# EAGLE design IC382_safety (EAGLE 7.5.0)
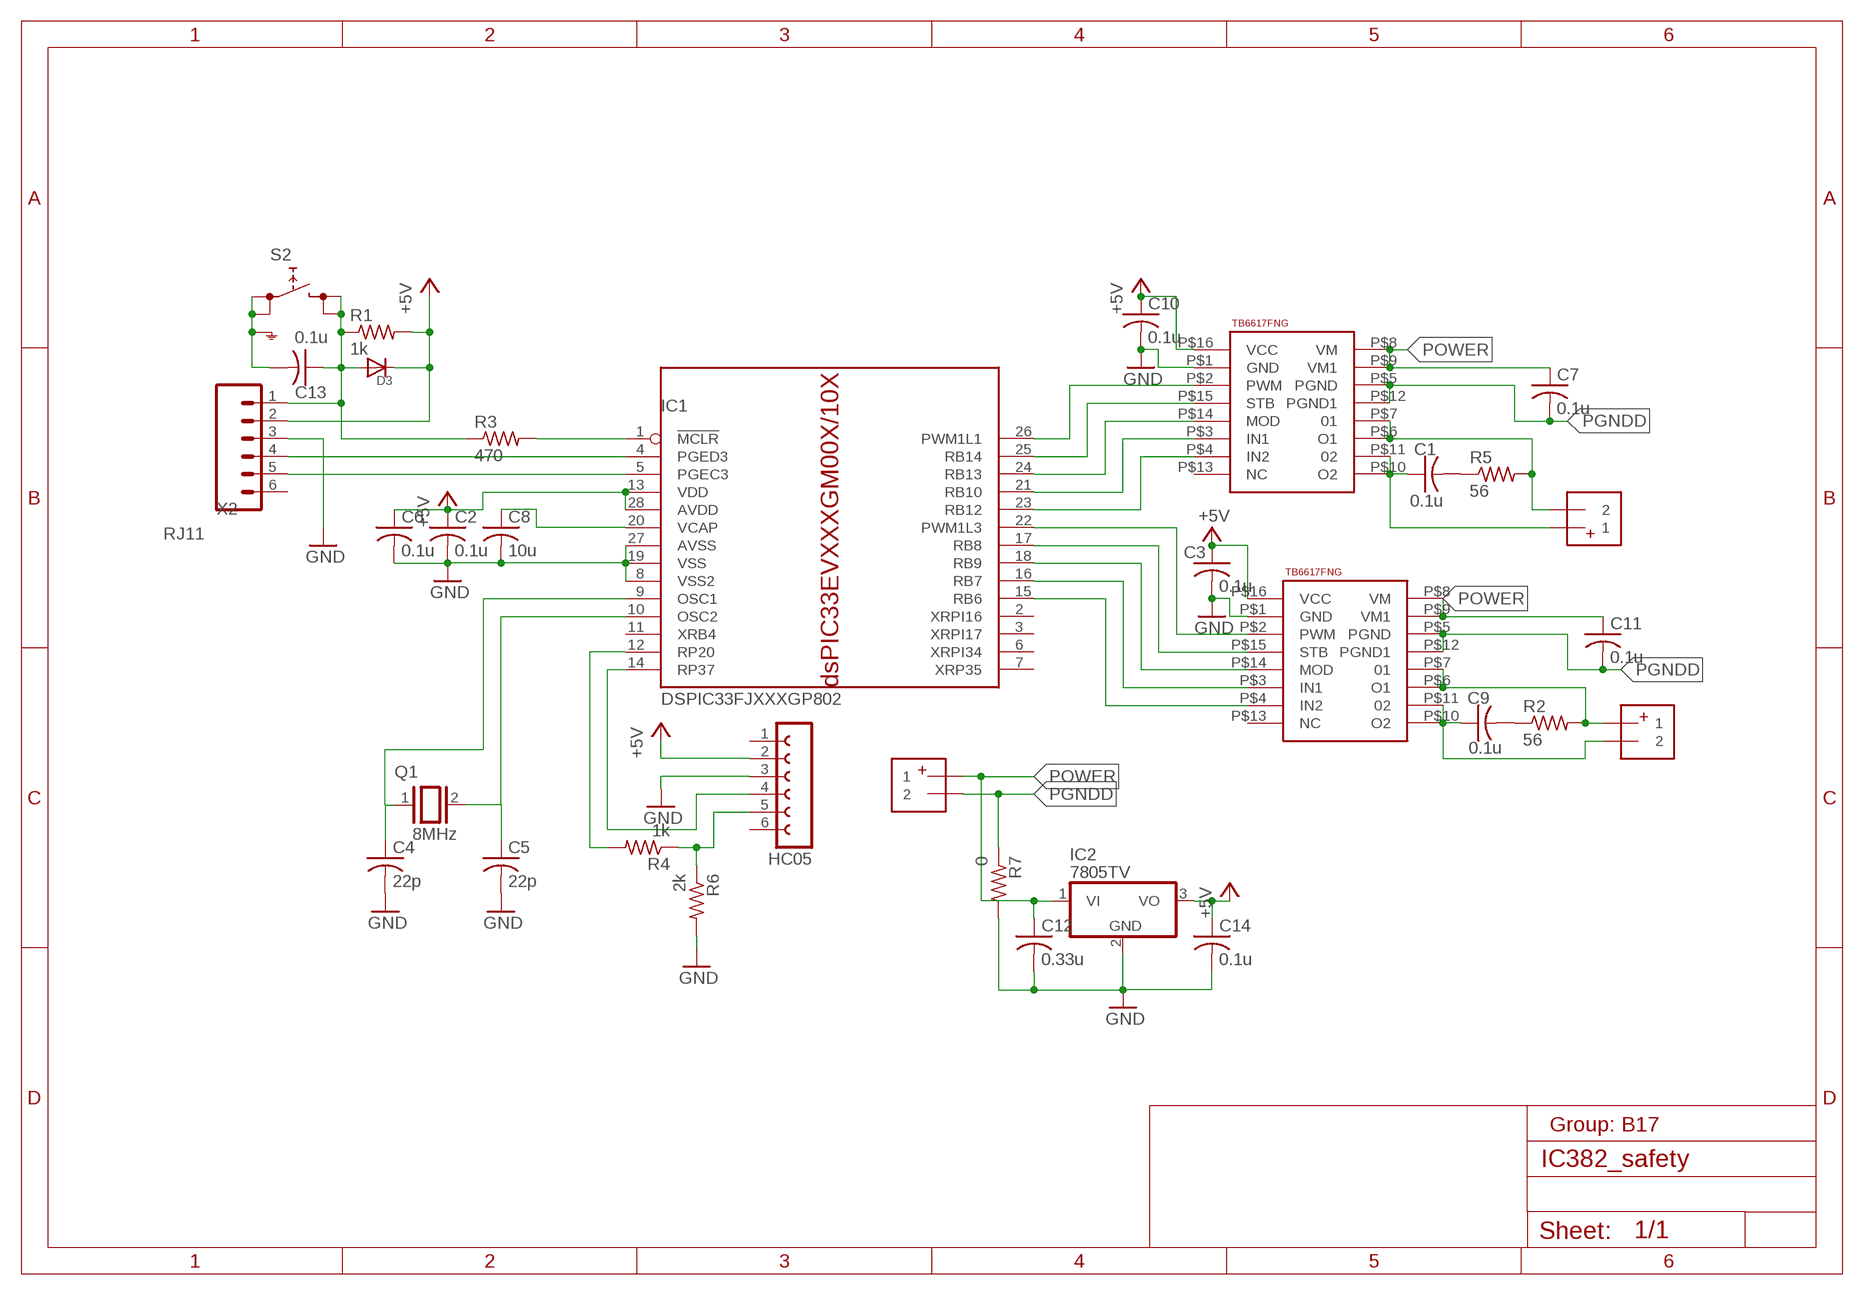
[diagram p0: schematic, sheet 1]

## Parts
C1  0.1u  C-USC0805  [C0805]
C2  0.1u  C-USC0805  [C0805]
C3  0.1u  C-USC0805  [C0805]
C4  22p  C-USC0805  [C0805]
C5  22p  C-USC0805  [C0805]
C6  0.1u  C-USC0805  [C0805]
C7  0.1u  C-USC0805  [C0805]
C8  10u  C-USC0805  [C0805]
C9  0.1u  C-USC0805  [C0805]
C10  0.1u  C-USC0805  [C0805]
C11  0.1u  C-USC0805  [C0805]
C12  0.33u  C-USC0805  [C0805]
C13  0.1u  C-USC0805  [C0805]
C14  0.1u  C-USC0805  [C0805]
D3  DIODESOD-123  [SOD-123]
DRIVER1  SSOP16  [SSOP16]
DRIVER2  SSOP16  [SSOP16]
HC05  FE06-1  [FE06]
IC1  DSPIC33FJXXXGP802  [SO28W]
IC2  7805TV  [TO220V]
J1  1X2-3.5MM  [1X2-3.5MM]
J2  1X2-3.5MM  [1X2-3.5MM]
POWERSUPPLY  1X2-3.5MM  [1X2-3.5MM]
Q1  8MHz  XTAL/S  [QS]
R1  1k  R-US_M0805  [M0805]
R2  56  R-US_M0805  [M0805]
R3  470  R-US_M0805  [M0805]
R4  1k  R-US_M0805  [M0805]
R5  56  R-US_M0805  [M0805]
R6  2k  R-US_M0805  [M0805]
R7  0  R-US_M0805  [M0805]
S2  SKHMPWE010  [SKHMPXE010]
X2  RJ11  RJ11-6PTH  [RJ11-6]

## Nets
+5V: C2.1 C3.1 C6.1 C10.1 C14.1 D3.C DRIVER1.P$16(VCC) DRIVER2.P$16(VCC) HC05.2 IC1.13(VDD) IC1.28(AVDD) IC2.3(VO) R1.2 X2.2
GND: C2.2 C3.2 C4.2 C5.2 C6.2 C8.2 C10.2 C12.2 C14.2 DRIVER1.P$1(GND) DRIVER2.P$1(GND) HC05.3 IC1.8(VSS2) IC1.19(VSS) IC1.27(AVSS) IC2.2(GND) R6.2 R7.2 X2.3
M-2: DRIVER1.P$6(O1) DRIVER1.P$7 J1.2 R5.2
N$1: HC05.4 IC1.14(RP37)
N$2: C5.1 IC1.10(OSC2) Q1.2
N$3: IC1.4(PGED3) X2.4
N$4: DRIVER2.P$4(IN2) IC1.15(RB6)
N$5: C8.1 IC1.20(VCAP)
N$6: C13.1 D3.A R1.1 R3.1 S2.3(2.1) S2.4(2.2) X2.1
N$7: DRIVER2.P$2(PWM) IC1.22(PWM1L3)
N$8: IC1.1(!MCLR) R3.2
N$9: IC1.5(PGEC3) X2.5
N$10: C4.1 IC1.9(OSC1) Q1.1
N$11: IC1.12(RP20) R4.2
N$12: DRIVER1.P$2(PWM) IC1.26(PWM1L1)
N$13: DRIVER1.P$15(STB) IC1.25(RB14)
N$14: DRIVER1.P$14(MOD) IC1.24(RB13)
N$15: DRIVER1.P$3(IN1) IC1.21(RB10)
N$16: DRIVER1.P$4(IN2) IC1.23(RB12)
N$17: DRIVER2.P$15(STB) IC1.17(RB8)
N$18: C1.1 DRIVER1.P$10(O2) DRIVER1.P$11 J1.1
N$19: DRIVER2.P$14(MOD) IC1.18(RB9)
N$20: C1.2 R5.1
N$21: DRIVER2.P$3(IN1) IC1.16(RB7)
N$22: HC05.5 R4.1 R6.1
N$23: C13.2 S2.1(1.1) S2.2(1.2) S2.5(SH)
N$24: DRIVER2.P$6(O1) DRIVER2.P$7 J2.1 R2.2
N$25: C9.1 DRIVER2.P$10(O2) DRIVER2.P$11 J2.2
N$26: C9.2 R2.1
PGNDD: C7.2 C11.2 DRIVER1.P$5(PGND) DRIVER1.P$12(PGND1) DRIVER2.P$5(PGND) DRIVER2.P$12(PGND1) POWERSUPPLY.2 R7.1
POWER: C7.1 C11.1 C12.1 DRIVER1.P$8(VM) DRIVER1.P$9(VM1) DRIVER2.P$8(VM) DRIVER2.P$9(VM1) IC2.1(VI) POWERSUPPLY.1
Unconnected: DRIVER1.P$13(NC) DRIVER2.P$13(NC) HC05.1 HC05.6 IC1.2(XRPI16) IC1.3(XRPI17) IC1.6(XRPI34) IC1.7(XRP35) IC1.11(XRB4) X2.6

## Library data of the parts
C1-C14 = adafruit:C-US: CAPACITOR, American symbol
D3 = adafruit:DIODE: Diode SMADIODE - SMA Surface Mount Package 20V 1A Schottky Diode Digikey: 641-1014-6-ND DO-1N4148 - Through Hole Small Current Diode SOD-123 20V 1 A (.5mV Vf) Schottky Diode - Digikey: MBRX120TPMSCT-ND SOD-323 10V 570mA (.38mV Vf, 3ns) Schottky Diode - Digikey: ZLLS410CT-ND SOD-523 30V 30mA Schottky Diode (RB751S-40TE61) - Digikey: RB751S-40TE61CT-ND SOT23-R/W - SOT23 Package (R = Solder Paste/Reflow Ovens, W = Hand-Soldering) BAT54Film 40V 300mA - Digikey: 497-7162-1-ND
DRIVER1 DRIVER2 = TB6617FNG:SSOP16
HC05 = con-lsta:FE06-1: FEMALE HEADER; OC_FARNELL: unknown; OC_NEWARK: unknown
IC1 = microchip-dspic33:DSPIC33FJXXXGP802: High-Performance, 16-bit Digital Signal Controllers - dsPIC33FJ64GP802 & dsPIC33FJ128GP802 Source: http://ww1.microchip.com/downloads/en/DeviceDoc/70292B.pdf Operating Range: . Up to 40 MIPS operation (at 3.0-3.6V): - Industrial temperature range (-40°C to +85°C) - Extended temperature range (-40°C to +125°C) High-Performance DSC CPU: . Modified Harvard architecture . C compiler optimized instruction set . 16-bit wide data path . 24-bit wide instructions . Linear program memory addressing up to 4M instruction words . Linear data memory addressing up to 64 Kbytes . 83 base instructions: mostly 1 word/1 cycle . Two 40-bit accumulators with rounding and saturation options . Flexible and powerful addressing modes: - Indirect - Modulo - Bit-Reversed . Software stack . 16 x 16 fractional/integer multiply operations . 32/16 and 16/16 divide operations . Single-cycle multiply and accumulate: - Accumulator write back for DSP operations - Dual data fetch . Up to ±16-bit shifts for up to 40-bit data On-Chip Flash and SRAM: . Flash program memory . Data SRAM . Boot, Secure, and General Security for program Flash Direct Memory Access (DMA): . 8-channel hardware DMA . Up to 2 Kbytes dual ported DMA buffer area (DMA RAM) to store data transferred via DMA: - Allows data transfer between RAM and a peripheral while CPU is executing code (no cycle stealing) . Most peripherals support DMA Timers/Capture/Compare/PWM: . Timer/Counters, up to five 16-bit timers: - Can pair up to make two 32-bit timers - One timer runs as a Real-Time Clock with an external 32.768 kHz oscillator - Programmable prescaler . Input Capture (up to four channels): - Capture on up, down or both edges - 16-bit capture input functions - 4-deep FIFO on each capture . Output Compare (up to four channels): - Single or Dual 16-bit Compare mode - 16-bit Glitchless PWM mode . Hardware Real-Time Clock/Calendar (RTCC): - Provides clock, calendar, and alarm functions Interrupt Controller: . 5-cycle latency . 118 interrupt vectors . Up to 49 available interrupt sources . Up to three external interrupts . Seven programmable priority levels . Five processor exceptions Digital I/O: . Peripheral pin Select functionality . Up to 35 programmable digital I/O pins . Wake-up/Interrupt-on-Change for up to 21 pins . Output pins can drive from 3.0V to 3.6V . Up to 5V output with open drain configuration . All digital input pins are 5V tolerant . 4 mA sink on all I/O pins System Management: . Flexible clock options: - External, crystal, resonator, internal RC - Fully integrated Phase-Locked Loop (PLL) - Extremely low jitter PLL . Power-up Timer . Oscillator Start-up Timer/Stabilizer . Watchdog Timer with its own RC oscillator . Fail-Safe Clock Monitor . Reset by multiple sources Power Management: . On-chip 2.5V voltage regulator . Switch between clock sources in real time . Idle, Sleep, and Doze modes with fast wake-up Analog-to-Digital Converters (ADCs): . 10-bit, 1.1 Msps or 12-bit, 500 Ksps conversion: - Two and four simultaneous samples (10-bit ADC) - Up to 13 input channels with auto-scanning - Conversion start can be manual or synchronized with one of four trigger sources - Conversion possible in Sleep mode - ±2 LSb max integral nonlinearity - ±1 LSb max differential nonlinearity Audio Digital-to-Analog Converter (DAC): . 16-bit Dual Channel DAC module . 100 Ksps maximum sampling rate . Second-Order Digital Delta-Sigma Modulator Data Converter Interface (DCI) module: . Codec interface . Supports I2S and AC.97 protocols . Up to 16-bit data words, up to 16 words per frame . 4-word deep TX and RX buffers Comparator Module: . Two analog comparators with programmable input/output configuration CMOS Flash Technology: . Low-power, high-speed Flash technology . Fully static design . 3.3V (±10%) operating voltage . Industrial and Extended temperature . Low power consumption Communication Modules: . 4-wire SPI (up to two modules): - Framing supports I/O interface to simple codecs - Supports 8-bit and 16-bit data - Supports all serial clock formats and sampling modes . I2C?: - Full Multi-Master Slave mode support - 7-bit and 10-bit addressing - Bus collision detection and arbitration - Integrated signal conditioning - Slave address masking . UART (up to two modules): - Interrupt on address bit detect - Interrupt on UART error - Wake-up on Start bit from Sleep mode - 4-character TX and RX FIFO buffers - LIN bus support - IrDA® encoding and decoding in hardware - High-Speed Baud mode - Hardware Flow Control with CTS and RTS . Enhanced CAN (ECAN. module) 2.0B active: - Up to eight transmit and up to 32 receive buffers - 16 receive filters and three masks - Loopback, Listen Only and Listen All - Messages modes for diagnostics and bus monitoring - Wake-up on CAN message - Automatic processing of Remote Transmission Requests - FIFO mode using DMA - DeviceNet. addressing support . Parallel Master Slave Port (PMP/EPSP): - Supports 8-bit or 16-bit data - Supports 16 address lines . Programmable Cyclic Redundancy Check (CRC): - Programmable bit length for the CRC generator polynomial (up to 16-bit length) - 8-deep, 16-bit or 16-deep, 8-bit FIFO for data input
IC2 = linear:78*: Positive VOLTAGE REGULATOR Source: http://cache.national.com/ds/LM/LM78L05.pdf http://www.fairchildsemi.com/ds/LM/LM7805.pdf
J1 J2 POWERSUPPLY = adafruit:1X2: 3.5mm Terminal block http://www.ladyada.net/library/pcb/eaglelibrary.html
Q1 = special:XTAL/S: CRYSTAL
R1-R7 = adafruit:R-US_: RESISTOR, American symbol
S2 = switch:SKHMP*E010: 6.2 X 6.5mm TACT Switch (SMD) Source: http://www3.alps.co.jp/WebObjects/catalog.woa/PDF/E/Switch/Tact/SKHM/SKHM.PDF
X2 = SparkFun-Connectors:RJ11-6: RJ11 Jack Simple 6 pin RJ11 jack. Commonly found on CAT3 devices and Microchip programmers. SKU: PRT-00132; PROD_ID: CONN-08590

## Module ABC
Ports: 

### Library data of the parts

## Board
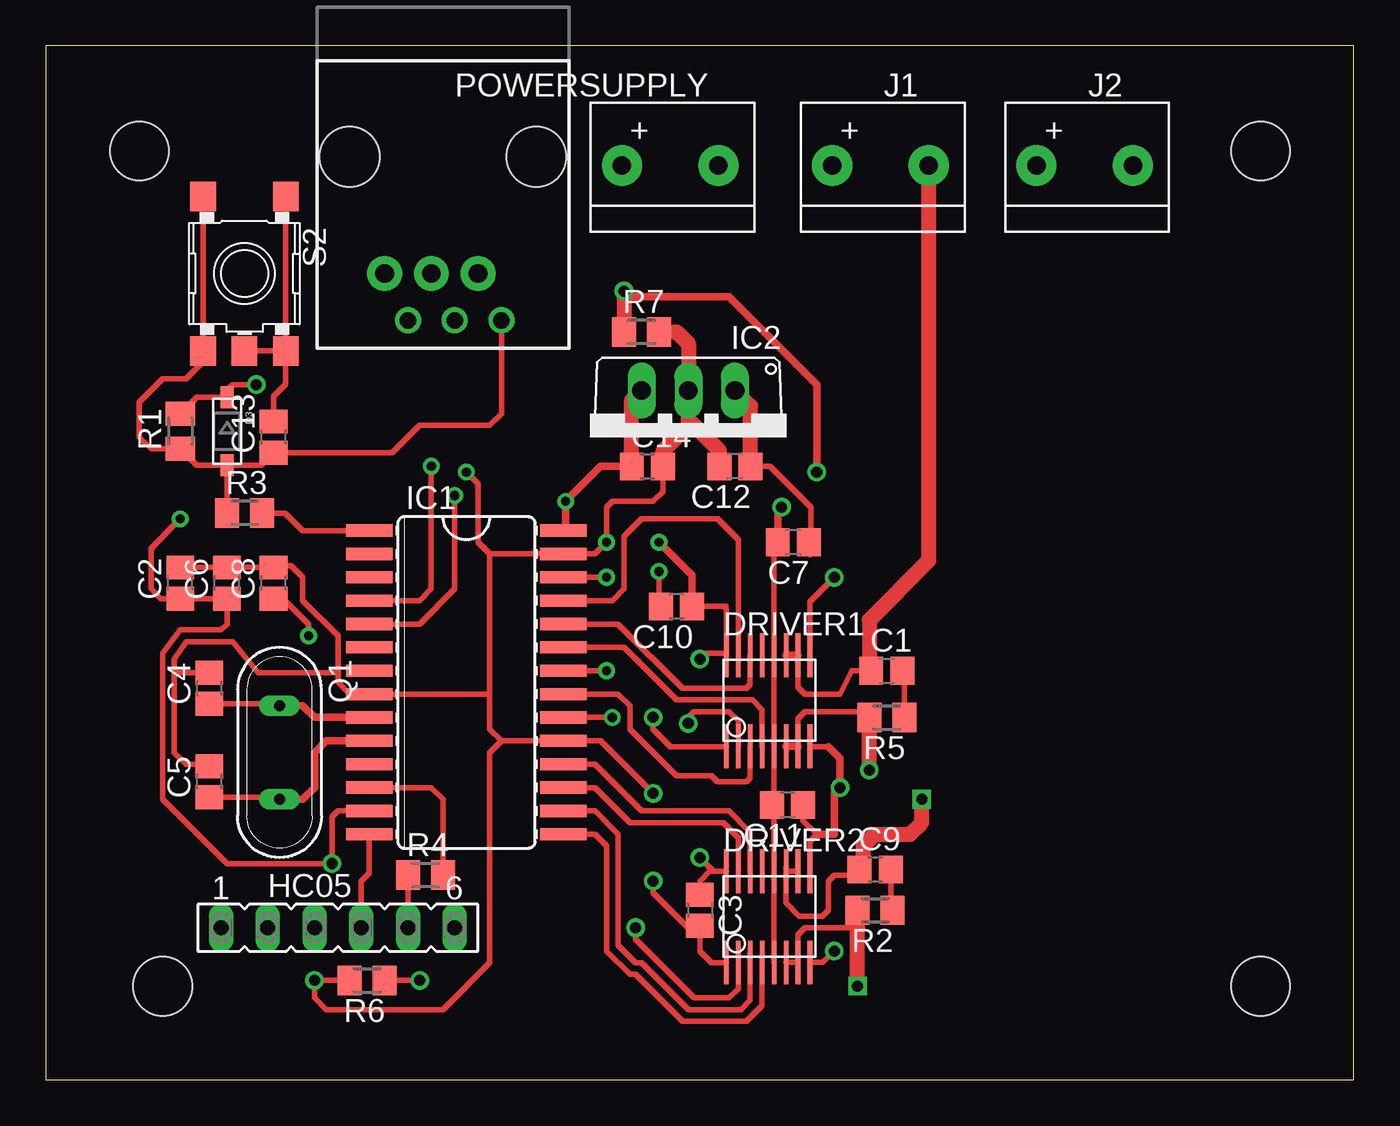
[diagram p1: board, top side]
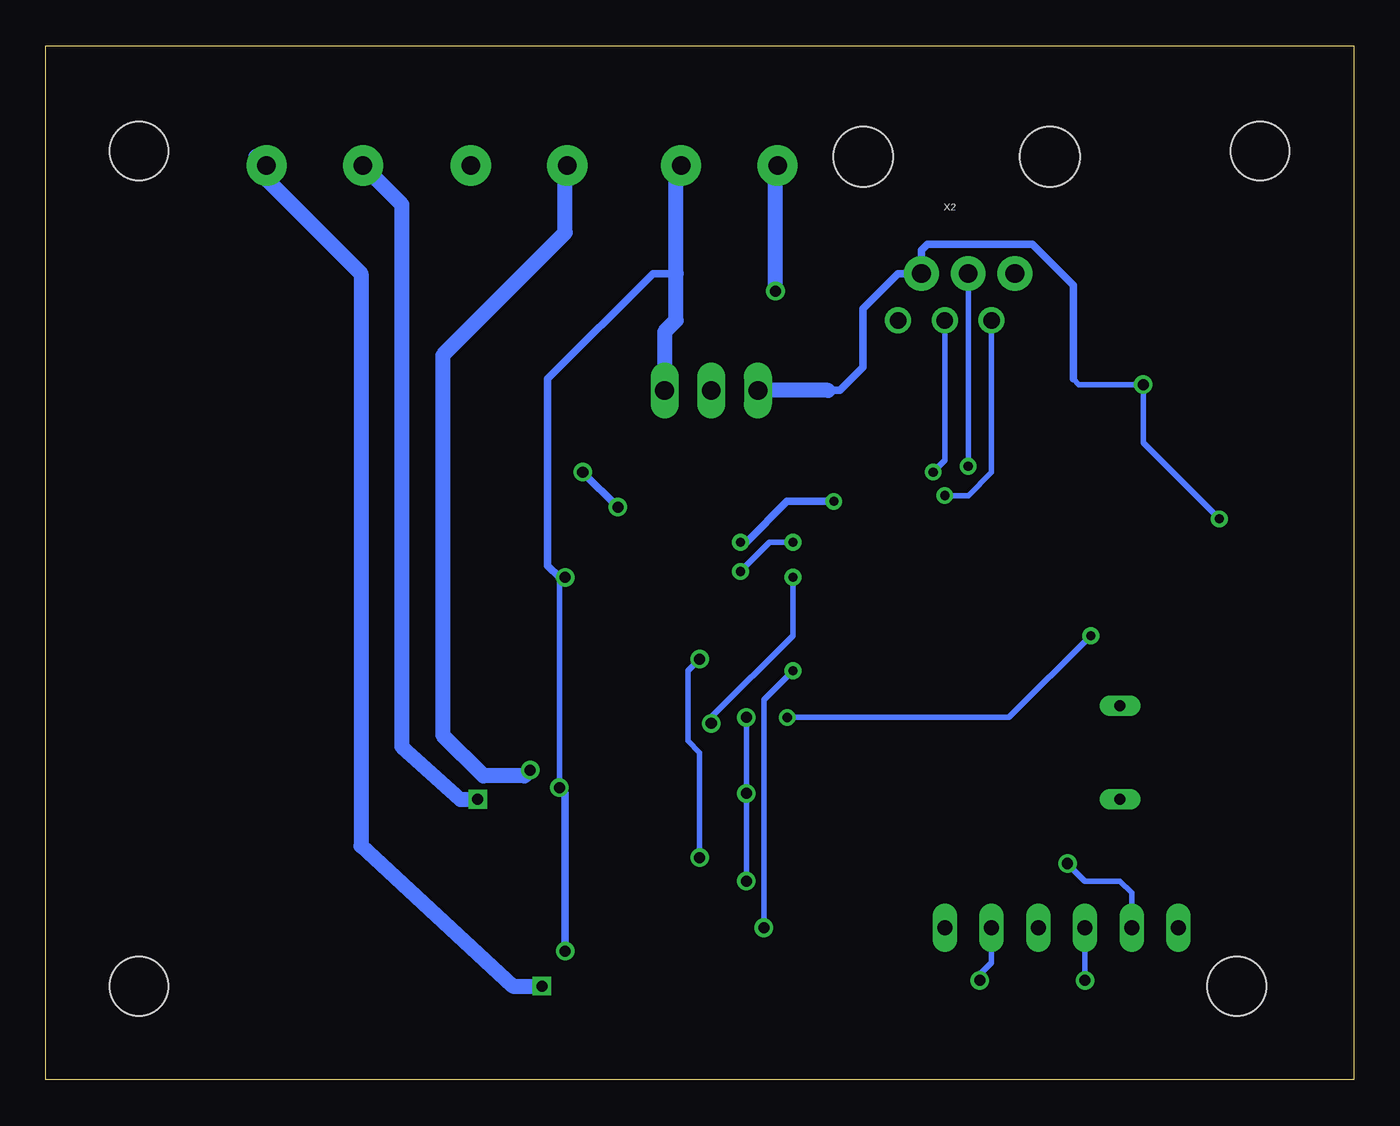
[diagram p2: board, bottom side, seen from below]

Size 71.1 x 56.19 mm. Coordinates in mm from the lower left corner, seen from the top.
Outline: 0,0 71.1,0 71.1,56.19 0,56.19 0,0
Copper layers (1*16): Top 0.035mm / dielectric 1.5mm / Bottom 0.035mm
Design rules "default": minimum track width 10mil, minimum drill 24mil, track to track 8mil, track to pad 8mil, pad to pad 8mil, via to via 8mil, smd to smd 8mil, copper to edge 40mil, drill to drill 8mil, minimum pad ring 10mil, minimum via ring 8mil, stop-mask expansion 4mil, vias tented up to drill 0mil, thermal gap 10mil
Holes 3.2 mm at 5.08,50.48 6.35,5.08 66.04,5.08 66.04,50.48

### Footprints (pad centres in the part's own frame; a part is rotated, then mirrored left to right if it is on the bottom)
C0805 = smd 1.3 x 1.5: 1 -0.85,0; 2 0.85,0
SOD-123 = smd 1.2 x 0.7: A 1.85,0; C -1.85,0
SSOP16 = smd 0.254 x 2.388: P$1 0.165,-2.522; P$2 0.815,-2.522; P$3 1.465,-2.522; P$4 2.115,-2.522; P$5 2.765,-2.522; P$6 3.415,-2.522; P$7 4.065,-2.522; P$8 4.715,-2.522; P$9 4.715,2.436; P$10 4.065,2.436; P$11 3.415,2.436; P$12 2.765,2.436; P$13 2.115,2.436; P$14 1.465,2.436; P$15 0.815,2.436; P$16 0.165,2.436
FE06 = drill 0.813 long: 1 -6.35,0; 2 -3.81,0; 3 -1.27,0; 4 1.27,0; 5 3.81,0; 6 6.35,0
SO28W = smd 0.66 x 2.532: 1 -8.255,-5.279; 2 -6.985,-5.279; 3 -5.715,-5.279; 4 -4.445,-5.279; 5 -3.175,-5.279; 6 -1.905,-5.279; 7 -0.635,-5.279; 8 0.635,-5.279; 9 1.905,-5.279; 10 3.175,-5.279; 11 4.445,-5.279; 12 5.715,-5.279; 13 6.985,-5.279; 14 8.255,-5.279; 15 8.255,5.279; 16 6.985,5.279; 17 5.715,5.279; 18 4.445,5.279; 19 3.175,5.279; 20 1.905,5.279; 21 0.635,5.279; 22 -0.635,5.279; 23 -1.905,5.279; 24 -3.175,5.279; 25 -4.445,5.279; 26 -5.715,5.279; 27 -6.985,5.279 | smd 0.66 x 2.533: 28 -8.255,5.279
TO220V = drill 1.016 long: 1 -2.54,-2.54; 2 0,-2.54; 3 2.54,-2.54
1X2-3.5MM = drill 1 pad 2.184: 1 7.039,3.651; 2 1.792,3.651
QS = drill 0.61 long: 1 -2.54,0; 2 2.54,0
M0805 = smd 1.3 x 1.6: 1 -0.95,0; 2 0.95,0
SKHMPXE010 = smd 1.6 x 1.4: 1 -4.2,2.25; 2 4.2,2.25; 3 -4.2,-2.25; 4 4.2,-2.25; 5 4.2,0
RJ11-6 = drill 0.9 pad 1.422: 1 -3.175,8.89; 3 -0.635,8.89; 5 1.905,8.89 | drill 1.016 pad 1.88: 2 -1.905,6.35; 4 0.635,6.35; 6 3.175,6.35 | hole 3.251: -5.08,0; 5.08,0

### Placement (x,y rotation side)
C1  45.72,22.23 0 top
C2  7.3,26.99 90 top
C3  35.56,9.21 270 top
C4  8.89,21.27 90 top
C5  8.89,16.19 90 top
C6  9.84,26.99 90 top
C7  40.64,29.21 180 top
C8  12.38,26.99 90 top
C9  45.09,11.43 0 top
C10  34.29,25.72 180 top
C11  40.32,14.92 180 top
C12  37.47,33.34 180 top
C13  12.38,34.92 90 top
C14  32.7,33.34 0 top
D3  9.84,35.24 270 top
DRIVER1  36.83,20.64 0 top
DRIVER2  36.83,8.89 0 top
HC05  15.88,8.26 0 top
IC1  22.86,21.59 270 top
IC2  34.92,34.92 180 top
J1  40.96,46.04 0 top
J2  52.07,46.04 0 top
POWERSUPPLY  29.53,46.04 0 top
Q1  12.7,17.78 270 top
R1  7.3,35.24 90 top
R2  45.09,9.21 180 top
R3  10.79,30.8 0 top
R4  20.64,11.11 0 top
R5  45.72,19.68 180 top
R6  17.46,5.4 180 top
R7  32.38,40.64 0 top
S2  10.79,43.81 270 top
X2  21.59,50.16 180 top

### Tracks (layer width: path | path; a pad name or v marks a point on that pad's centre or on a via)
+5V  (via drill 0.5, 0.6)
  Top 0.305: v11.43,37.78 10.16,37.78 9.84,37.47 D3.C 8.2,37.09 R1.2 | C10.1 36.83,25.72 | 36.83,25.72 36.97,25.72 | IC1.13 15.88,14.61 15.56,14.29 v15.56,11.75 9.84,11.75 6.35,15.24 6.35,23.18 7.3,24.45 9.53,24.45 9.84,24.77 C6.1 C2.1 6.25,26.14 5.71,26.67 5.71,28.89 v7.3,30.48 | 36.83,25.72 36.99,25.55 DRIVER1.P$16 36.89,23.18 35.56,23.18 v35.56,22.86 | C3.1 35.56,10.79 36.09,11.32 DRIVER2.P$16 36.3,11.32 v35.56,12.06
  Top 0.406: C10.1 35.14,27.41 v33.34,29.21 | IC1.28 28.26,29.96 v28.26,31.43 30.16,33.34 C14.1
  Top 0.813: C14.1 31.85,36.93 IC2.3
  Bottom 0.305: 15.24,38.1 14.92,37.78 v11.43,37.78 11.43,34.61 v7.3,30.48 | HC05.2 12.06,10.16 12.7,10.79 14.61,10.79 v15.56,11.75 | v35.56,12.06 35.56,17.78 36.2,18.41 36.2,22.23 v35.56,22.86
  Bottom 0.406: v33.34,29.21 33.02,29.21 30.8,31.43 v28.26,31.43 | 15.24,38.1 15.24,43.18 17.46,45.4 23.18,45.4 23.5,45.09 X2.2 24.77,43.81 26.67,41.91 26.67,38.73 27.94,37.47 28.57,37.47
  Bottom 0.813: 28.57,37.47 IC2.3
GND  (via drill 0.5, 0.6)
  Top 0.305: v33.34,27.62 33.34,25.82 C10.2 | C14.2 33.55,31.96 33.02,31.43 30.8,31.43 30.48,31.11 v30.48,29.21 29.84,28.57 IC1.27 24.13,28.57 | v22.86,33.02 23.5,32.38 23.5,29.21 24.13,28.57 | C2.2 C6.2 C8.2 | 8.68,21.91 C4.2 7.09,22.12 6.99,22.23 | R6.2 v14.61,5.4 14.61,4.45 15.24,3.81 21.59,3.81 24.13,6.35 24.13,17.78 24.77,18.41 | 24.77,18.41 IC1.19 30.16,18.41 v33.02,15.56 | 24.13,20.95 IC1.8 16.51,20.95 15.88,21.59 15.88,22.23 | 24.13,28.57 24.13,20.95 | 24.13,20.95 24.13,19.05 24.77,18.41 | v33.02,10.79 33.02,10.16 35.24,7.94 35.24,8.04 C3.2 35.56,6.99 36.2,6.35 36.98,6.35 DRIVER2.P$1 | 33.02,19.72 v33.02,19.68 33.02,19.05 33.97,18.1 36.98,18.1 DRIVER1.P$1 | 15.88,22.23 15.88,24.13 13.97,26.04 13.97,27.3 13.34,27.94 12.48,27.94 C8.2 | 12.6,27.62 C8.2 | 15.88,22.23 15.77,22.12 11.53,22.12 10.16,23.81 7.62,23.81 6.99,22.86 6.99,22.23 | 6.99,22.23 6.99,17.78 7.62,17.14 8.79,17.14 C5.2
  Top 0.813: R7.2 34.29,40.64 34.92,40.01 IC2.2 34.92,35.88 | C14.2 33.55,34.19 34.92,35.56 34.92,35.88 | C12.2 36.62,34.19 34.92,35.88
  Bottom 0.305: v30.48,29.21 31.75,29.21 v33.34,27.62 | X2.3 22.23,33.66 v22.86,33.02 | v33.02,10.79 v33.02,15.56 v33.02,19.68 | HC05.3 v14.61,5.4
M-2  (via drill 0.6)
  Top 0.305: DRIVER1.P$7 40.9,19.62 41.27,20 44.45,20 R5.2
  Top 0.406: DRIVER1.P$6 DRIVER1.P$7
  Top 0.813: v44.77,16.83 R5.2
  Bottom 0.813: v44.77,16.83 45.09,16.51 47.31,16.51 49.53,18.73 49.53,39.37 42.86,46.04 42.86,49.58 J1.2
N$1
  Top 0.305: IC1.14 17.58,11.23 17.14,10.79 HC05.4
N$2
  Top 0.305: C5.1 12.6,15.34 Q1.2
  Top 0.406: Q1.2 13.97,15.24 14.61,15.88 14.61,17.78 15.24,18.41 IC1.10
N$3  (via drill 0.5)
  Top 0.305: IC1.4 20.32,26.04 20.95,26.67 v20.95,33.34
  Bottom 0.305: v20.95,33.34 X2.4
N$4
  Top 0.305: IC1.15 29.84,13.34 30.48,12.7 30.48,6.99 31.75,5.71 32.07,5.71 34.61,3.17 38.1,3.17 38.95,4.02 DRIVER2.P$4 38.95,6.56
N$5  (via drill 0.5)
  Top 0.305: IC1.20 v30.8,19.68 | v14.29,24.13 14.29,24.77 13.02,26.04 12.48,26.04 C8.1
  Bottom 0.305: v30.8,19.68 18.73,19.68 v14.29,24.13
N$6
  Top 0.305: D3.A 8.2,33.39 R1.1 5.71,34.29 5.08,34.92 5.08,36.83 6.35,38.1 7.62,38.1 8.57,39.05 8.57,39.59 S2.4 S2.3 | R3.1 D3.A | D3.A 11.7,33.39 C13.1 18.84,34.08 20.32,35.56 24.13,35.56 24.77,36.2 X2.1
N$7  (via drill 0.5, 0.6)
  Top 0.305: IC1.22 v30.48,22.23 | v32.07,8.26 32.07,7.62 35.24,4.45 37.15,4.45 37.65,4.94 DRIVER2.P$2 37.65,7.17
  Bottom 0.305: v30.48,22.23 32.07,20.64 v32.07,8.26
N$8
  Top 0.305: R3.2 13.02,30.8 13.97,29.84 IC1.1
N$9  (via drill 0.5)
  Top 0.305: IC1.5 20.32,24.77 22.23,26.67 v22.23,31.75
  Bottom 0.305: v22.23,31.75 20.95,31.75 19.68,33.02 X2.5
N$10
  Top 0.305: C4.1 12.6,20.42 Q1.1
  Top 0.406: Q1.1 13.97,20.32 14.61,19.68 IC1.9
N$11
  Top 0.305: R4.2 21.59,15.24 20.95,15.88 IC1.12
N$12  (via drill 0.5, 0.6)
  Top 0.305: IC1.26 v30.48,27.3 | DRIVER1.P$2 37.65,19.5 37.15,20 35.24,20 34.92,19.68 v34.92,19.37
  Bottom 0.305: v30.48,27.3 30.48,24.13 34.92,19.68 v34.92,19.37
N$13
  Top 0.305: IC1.25 30.8,26.04 31.43,26.67 31.43,29.53 32.38,30.48 36.51,30.48 37.65,29.35 DRIVER1.P$15
N$14
  Top 0.305: IC1.24 31.11,24.77 34.61,21.27 38.1,21.27 38.3,21.47 DRIVER1.P$14
N$15
  Top 0.305: IC1.21 31.11,20.95 31.75,20.32 31.75,19.05 34.29,16.51 36.2,16.51 36.51,16.19 38.1,16.19 38.3,16.39 DRIVER1.P$3
N$16
  Top 0.305: IC1.23 31.43,23.5 34.29,20.64 38.42,20.64 38.95,20.11 DRIVER1.P$4
N$17
  Top 0.305: DRIVER2.P$15 37.65,13.15 36.83,13.97 31.75,13.97 29.84,15.88 IC1.17
N$18
  Top 0.305: C1.1 43.81,22.23 43.18,20.95 41.27,20.95 40.9,21.34 DRIVER1.P$10
  Top 0.406: DRIVER1.P$11 DRIVER1.P$10
  Top 0.813: 45.09,22.44 C1.1 44.77,22.33 44.77,24.98 48,28.2 J1.1
N$19
  Top 0.305: DRIVER2.P$14 38.3,13.46 37.15,14.61 32.38,14.61 29.84,17.14 IC1.18
N$20
  Top 0.305: R5.1 46.67,22.12 C1.2
N$21
  Top 0.305: IC1.16 29.84,14.61 31.11,13.34 31.11,7.3 32.07,6.35 32.38,6.35 34.92,3.81 37.78,3.81 38.3,4.32 DRIVER2.P$3 38.3,6.86
N$22  (via drill 0.6)
  Top 0.305: v19.68,8.25 HC05.5 R4.1 | v20.32,5.4 R6.1
  Bottom 0.305: v19.68,8.25 19.68,6.35 20.32,5.71 v20.32,5.4
N$23
  Top 0.305: S2.5 S2.2 | S2.2 S2.1 | 12.41,35.8 C13.2 12.38,37.15 13.04,37.81 S2.2
N$24  (via drill 0.6)
  Top 0.305: DRIVER2.P$6 DRIVER2.P$7 40.9,7.88 41.27,8.26 44.13,8.26 | 44.13,8.26
  Top 0.813: v44.13,5.08 44.13,8.26 R2.2
  Bottom 0.813: v44.13,5.08 45.72,5.08 53.98,12.7 53.98,43.81 59.69,49.53 59.69,50.16 J2.1
N$25  (via drill 0.6)
  Top 0.305: DRIVER2.P$11 40.24,11.51 | DRIVER2.P$11 40.24,9.6 40.96,8.89 42.23,8.89 42.55,9.21 42.55,10.79 42.86,11.11 43.92,11.11 C9.1 | DRIVER2.P$10 DRIVER2.P$11
  Top 0.813: C9.1 44.45,11.64 44.45,12.7 45.09,13.34 46.99,13.34 47.62,13.97 v47.62,15.24
  Bottom 0.813: v47.62,15.24 48.58,15.24 51.75,18.1 51.75,47.58 J2.2
N$26
  Top 0.305: C9.2 45.94,9.31 R2.1
PGNDD  (via drill 0.6)
  Top 0.305: DRIVER2.P$5 DRIVER2.P$12 39.59,15.12 | 39.59,28.38 39.63,28.52 | 39.63,28.52 C7.2 | 39.59,15.12 C11.2 | 39.59,15.12 DRIVER1.P$5 DRIVER1.P$12 39.59,28.48 39.63,28.52
  Top 0.406: C7.2 39.79,30.9 v40.01,31.11 | v41.91,33.02 41.91,37.78 37.15,42.55 31.75,42.55 v31.43,42.86
  Top 0.813: v31.43,42.86 R7.1
  Bottom 0.406: v40.01,31.11 v41.91,33.02
  Bottom 0.813: v31.43,42.86 31.43,49.69 POWERSUPPLY.2
POWER  (via drill 0.6)
  Top 0.305: 41.55,28.52 C7.1 | C7.1 41.59,28.68 41.59,31.11 39.37,33.34 C12.1 | DRIVER2.P$8 42.24,6.37 v42.86,6.99 | DRIVER2.P$9 41.55,12.97 41.91,13.34 41.17,14.07 C11.1 | 41.59,29.11 C7.1 | 42.55,18.1 41.56,18.1 DRIVER1.P$8 | DRIVER1.P$9 41.55,25.99 v42.86,27.3
  Top 0.406: 41.91,13.34 42.86,13.34 42.86,15.56 v43.18,15.88 43.18,17.46 42.55,18.1
  Top 0.813: C12.1 38.31,36.62 IC2.1
  Bottom 0.305: v43.18,15.88 43.18,26.99 v42.86,27.3
  Bottom 0.406: v42.86,6.99 42.86,15.56 v43.18,15.88 | v42.86,27.3 43.18,27.3 43.81,27.94 43.81,38.1 38.1,43.81 36.83,43.81
  Bottom 0.813: IC2.1 37.47,40.64 36.83,41.27 36.83,43.81 36.83,49.69 POWERSUPPLY.1